# Altium project 243-TGE-Template.PrjPcb
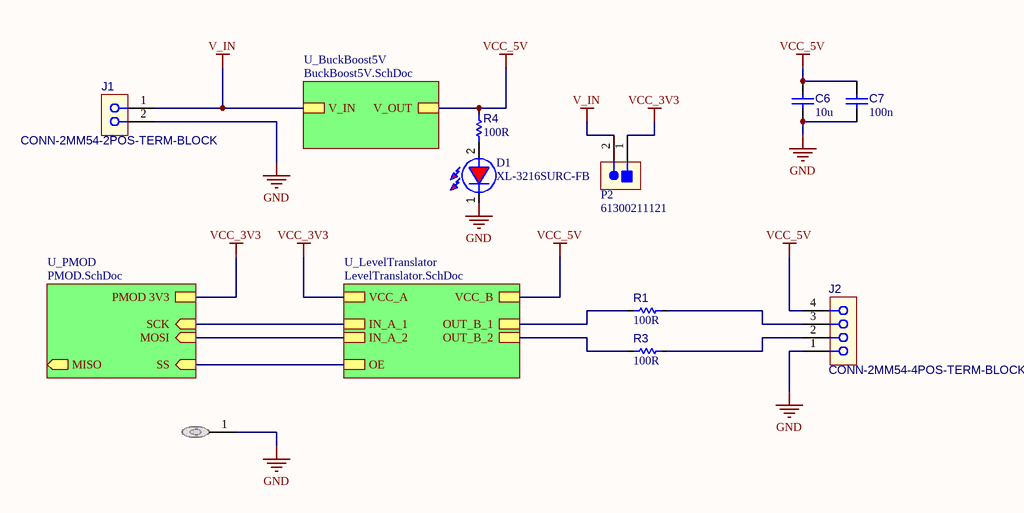
[diagram p0: HeadSheet.SchDoc]
NomDeLetudiant: Le nom de l'étudiant; NomDeProjet: Le nom de mon Projet; Revision: La Revision
4 sheets, 22 parts. Net scope: hierarchical (ports join the sheet entries above them; power ports are global).
Board file: Pcb1.PcbDoc
Sheets:
  HeadSheet.SchDoc
    U_BuckBoost5V = BuckBoost5V.SchDoc
    U_LevelTranslator = LevelTranslator.SchDoc
    U_PMOD = PMOD.SchDoc

## Sheet HeadSheet.SchDoc: Headsheet
size Letter; ApprovedBy: Kevin; Author: Jessica; Organization: Cegep Limoilou; Address1: 1300, 8e Avenue; Address2: Québec, QC; Address3: Canada; Address4: G1J 5L5; Revision: A; SheetNumber: 1; SheetTotal: 4

### Parts
C6  value 10u  [C_2012[0805]]  (hidden comment: CAP CER 10uF 10V X7R 0805)
C7  value 100n  [C_1608[0603]]  (hidden comment: CAP CER 100nF 50V 0603)
D1  XL-3216SURC-FB  [LED 1206]
J1  CONN-2MM54-2POS-TERM-BLOCK  [CONN_TERM_BLOCK_2POS_100MIL]
J2  CONN-2MM54-4POS-TERM-BLOCK  [CONN_TERM_BLOCK_4POS_100MIL]
MH1  DNP  [MP_M-Hole_#4-40_LOOSE-FIT]  (value not drawn)  (no BOM)
P2  61300211121  [CONN_HDR_2POS_100MILS_TH]
R1  value 100R  [R_1608[0603]]  (hidden comment: Res 100R 1% 0603)
R3  value 100R  [R_1608[0603]]  (hidden comment: Res 100R 1% 0603)
R4  value 100R  [R_1608[0603]]  (hidden comment: Res 100R 1% 0603)

### Sub-sheets
U_BuckBoost5V = BuckBoost5V.SchDoc: V_IN, V_OUT
U_LevelTranslator = LevelTranslator.SchDoc: VCC_A, VCC_B, OUT_B_1, OUT_B_2, IN_A_1, IN_A_2, OE
U_PMOD = PMOD.SchDoc: PMOD 3V3, SCK (in), MOSI (in), SS (in), MISO (out)

### Nets
GND: C6.1 C7.1 D1.1(K) J1.2 J2.1 MH1.1
V_IN: J1.1 P2.2 ; sheet U_BuckBoost5V/V_IN
VCC_3V3: P2.1 ; sheet U_LevelTranslator/VCC_A, sheet U_PMOD/PMOD 3V3
VCC_5V: C6.2 C7.2 J2.4 R4.2 ; sheet U_BuckBoost5V/V_OUT, sheet U_LevelTranslator/VCC_B
IN_A_1: sheet U_LevelTranslator/IN_A_1, sheet U_PMOD/SCK
IN_A_2: sheet U_LevelTranslator/IN_A_2, sheet U_PMOD/MOSI
OE: sheet U_LevelTranslator/OE, sheet U_PMOD/SS
OUT_B_1: R1.1 ; sheet U_LevelTranslator/OUT_B_1
OUT_B_2: R3.1 ; sheet U_LevelTranslator/OUT_B_2
NetD1_2: D1.2(A) R4.1
NetJ2_2: J2.2 R3.2
NetJ2_3: J2.3 R1.2

### Notes on the sheet
- Titre :
- Conception :
- Date :
- Approbation :
- Heure :
- Révision :
- Feuille
- de
- Fichier :

### Library data of the parts
C6 = CAP004: Capacitor type 1; Manufacturer 1: muRata; Manufacturer Part Number 1: GRM21BR71A106KE51L; LibRef: CAP004; Code CEGEP: KCOND03SM; Tolerance: 10%; Rated Voltage: 10V; Dielectric: X7R; Mounting Technology: SMT; Supplier 1: LCSC; Supplier Part Number 1: C86038
C7 = CAP002: Capacitor type 1; Manufacturer 1: Yageo; Manufacturer Part Number 1: CC0603KRX7R9BB104; LibRef: CAP002; Code CEGEP: COND0143SM; Tolerance: 10%; Dielectric: X7R; Rated Voltage: 50V; Mounting Technology: SMT; Supplier 1: LCSC; Supplier Part Number 1: C14663
D1 = D_LED_RED_1206: DEL Rouge 1206; Manufacturer 1: XINGLIGHT; Code CEGEP: LEDROUGECLAIR; Localisation: AVP-14; Manufacturer Part Number 1: XL-3216SURC-FB; Supplier 1: LCSC; Supplier Part Number 1: C3646938; Manufacturer 2: Würth Elektronik; Manufacturer Part Number 2: 150120RS75000; Supplier 2: Digikey; Supplier Part Number 2: 732-4991-1-ND; Mounting Technology: SMT
J1 = CONN-2MM54-2POS-TERM-BLOCK: CONN TERM BLOCK 2POS 100mil pitch; Manufacturer 1: Dorabo; Manufacturer Part Number 1: DB125-2.54-2P-GN-S; Supplier 1: LCSC; Supplier Part Number 1: C918120; Mounting Technology: TH; Manufacturer 2: Amphenol; Manufacturer Part Number 2: VN02A1500000G; Supplier 2: Digikey; Supplier Part Number 2: VN02A1500000G-ND
J2 = CONN-2MM54-4POS-TERM-BLOCK: CONN TERM BLOCK 4POS 100mil pitch; Manufacturer 1: Dorabo; Manufacturer Part Number 1: DB125-2.54-4P-GN-S; Supplier 1: LCSC; Supplier Part Number 1: C918122; Mounting Technology: TH; Manufacturer 2: Amphenol; Manufacturer Part Number 2: VN04A1500000G; Supplier 2: Digikey; Supplier Part Number 2: VN04A1500000G-ND
MH1 = MH-4-40: Mounting Hole #4-40 w/ Flat Washer; Manufacturer Part Number 1: DNP; Mounting Technology: N/A; Value: Mounting Hole #4-40 w/ Flat Washer; Supplier Part Number 1: N/A
P2 = CONN-100MIL-HDR-01X02: CONN HEADER 2POS 100MIL; Manufacturer 1: Megastar; Manufacturer Part Number 1: ZX-PZ2.54-1-2PZZ; Mounting Technology: TH; Supplier 1: LCSC; Supplier Part Number 1: C7501260; Manufacturer 2: Würth Elektronik; Manufacturer Part Number 2: 61300211121
R1 R3 R4 = RES029: Resistor type 1; Manufacturer 1: Yageo; Manufacturer Part Number 1: RC0603FR-07100RL; LibRef: RES029; Puissance: 1/10W; Max Working Voltage: 75V; Tolerance: 1%; Mounting Technology: SMT; Supplier 1: LCSC; Supplier Part Number 1: C105588

## Sheet BuckBoost5V.SchDoc: BuckBoost
size Letter; ApprovedBy: Kevin; Author: Jessica; Organization: Cegep Limoilou; Address1: 1300, 8e Avenue; Address2: Québec, QC; Address3: Canada; Address4: G1J 5L5; Revision: A; SheetNumber: 2; SheetTotal: 4
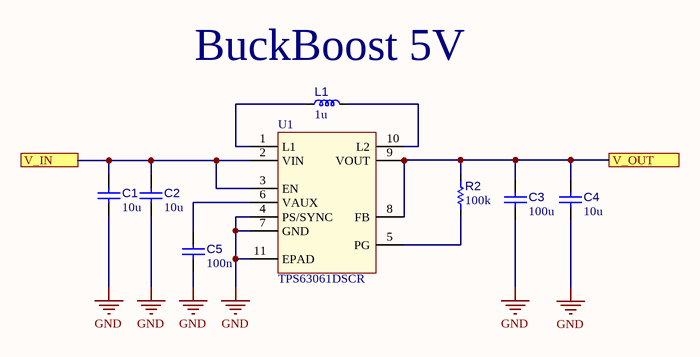
[diagram p1: BuckBoost5V.SchDoc]

### Parts
C1  value 10u  [C_2012[0805]]  (hidden comment: CAP CER 10uF 10V X7R 0805)
C2  value 10u  [C_2012[0805]]  (hidden comment: CAP CER 10uF 10V X7R 0805)
C3  value 100u  [C_3216[1206]]  (hidden comment: CAP CER 100uF 10V 1206)
C4  value 10u  [C_2012[0805]]  (hidden comment: CAP CER 10uF 10V X7R 0805)
C5  value 100n  [C_1005[0402]]  (hidden comment: CAP CER 100nF 50V 0402)
L1  value 1u  [L_4040[1515]]  (hidden comment: Inductor 1UH 3.2A 32mΩ SMD)
R2  value 100k  [R_1608[0603]]  (hidden comment: Res 100k 1% 0603)
U1  TPS63061DSCR  [U_WSON50P300X300X80-10N]

### Ports
V_IN, V_OUT

### Nets
GND: C1.1 C2.1 C3.1 C4.1 C5.1 U1.4(PS/SYNC) U1.7(GND) U1.11(EPAD)
V_IN: C1.2 C2.2 U1.2(VIN) U1.3(EN) ; port V_IN
VCC_5V: C3.2 C4.2 R2.2 U1.8(FB) U1.9(VOUT) ; port V_OUT
NetC5_2: C5.2 U1.6(VAUX)
NetL1_1: L1.1 U1.1(L1)
NetL1_2: L1.2 U1.10(L2)
NetR2_1: R2.1 U1.5(PG)

### Notes on the sheet
- (near L1) BuckBoost 5V
- Titre :
- Conception :
- Date :
- Approbation :
- Heure :
- Révision :
- Feuille
- de
- Fichier :

### Library data of the parts
C1 C2 C4 = CAP004: as C6 on sheet HeadSheet; Rated Voltage: 10V; Dielectric: X7R; Mounting Technology: SMT; Supplier 1: LCSC; Supplier Part Number 1: C86038
C3 = CAP005: Capacitor type 1; Manufacturer 1: Murata; Manufacturer Part Number 1: GRM31CR61A107MEA8L; LibRef: CAP005; Code CEGEP: KCOND04SM; Tolerance: 20%; Dielectric: X5R; Rated Voltage: 10V; Mounting Technology: SMT; Supplier 1: LCSC; Supplier Part Number 1: C883598
C5 = CAP001: Capacitor type 1; Manufacturer 1: Yageo; Manufacturer Part Number 1: CC0402KRX7R9BB104; LibRef: CAP001; Code CEGEP: KCOND01SM; Tolerance: 10%; Dielectric: X7R; Rated Voltage: 50V; Mounting Technology: SMT; Supplier 1: LCSC; Supplier Part Number 1: C131394
L1 = IND006: Inductor type 1; Manufacturer 1: Taiyo Yuden; Manufacturer Part Number 1: LSXND4040TKL1R0NDG; LibRef: IND006; Tolerance: 30%; Saturation Current: 4A; DCR: 0R032; Mounting Technology: SMT; Supplier 1: LCSC; Supplier Part Number 1: C6891223
R2 = RES002: Resistor type 1; Manufacturer 1: Yageo; Manufacturer Part Number 1: RC0603FR-07100KL; LibRef: RES002; Puissance: 1/10W; Max Working Voltage: 75V; Tolerance: 1%; Mounting Technology: SMT; Supplier 1: LCSC; Supplier Part Number 1: C14675
U1 = U_TPS63061DSC: IC REG BUCK BOOST 5V 2A 10WSON; Manufacturer 1: TI; Manufacturer Part Number 1: TPS63061DSCR; Mounting Technology: SMT; Supplier 1: LCSC; Supplier 2: Digikey; Supplier Part Number 1: C2876326; Supplier Part Number 2: 296-30205-1-ND

## Sheet LevelTranslator.SchDoc: LevelTranslator
size Letter; ApprovedBy: Kevin; Author: Jessica; Organization: Cegep Limoilou; Address1: 1300, 8e Avenue; Address2: Québec, QC; Address3: Canada; Address4: G1J 5L5; Revision: A; SheetNumber: 4; SheetTotal: 4
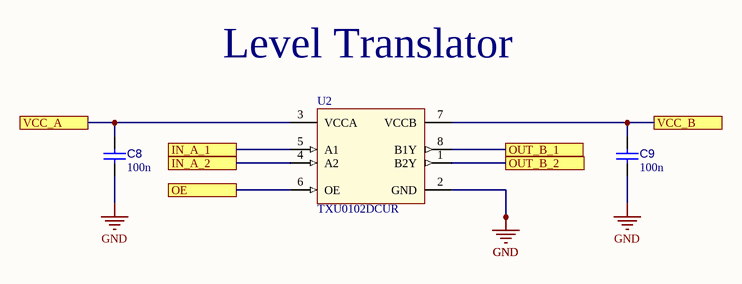
[diagram p2: LevelTranslator.SchDoc]

### Parts
C8  value 100n  [C_1608[0603]]  (hidden comment: CAP CER 100nF 50V 0603)
C9  value 100n  [C_1608[0603]]  (hidden comment: CAP CER 100nF 50V 0603)
U2  TXU0102DCUR  [U_VSSOP50P310X200X90-8N]

### Ports
IN_A_1, IN_A_2, OE, OUT_B_1, OUT_B_2, VCC_A, VCC_B

### Nets
GND: C8.1 C9.1 U2.2(GND)
VCC_3V3: C8.2 U2.3(VCCA) ; port VCC_A
VCC_5V: C9.2 U2.7(VCCB) ; port VCC_B
IN_A_1: U2.5(A1) ; port IN_A_1
IN_A_2: U2.4(A2) ; port IN_A_2
OE: U2.6(OE) ; port OE
OUT_B_1: U2.8(B1Y) ; port OUT_B_1
OUT_B_2: U2.1(B2Y) ; port OUT_B_2

### Notes on the sheet
- Level Translator
- Titre :
- Conception :
- Date :
- Approbation :
- Heure :
- Révision :
- Feuille
- de
- Fichier :

### Library data of the parts
C8 C9 = CAP002: as C7 on sheet HeadSheet; Rated Voltage: 50V; Mounting Technology: SMT; Supplier 1: LCSC; Supplier Part Number 1: C14663
U2 = U_TXU0102DCU: Two channel fixed-direction level shifter 8-VSSOP; Manufacturer 1: TI; Manufacturer Part Number 1: TXU0102DCUR; Mounting Technology: SMT; Supplier 1: LCSC; Supplier 2: Digikey; Supplier Part Number 1: C5217871; Supplier Part Number 2: 296-TXU0102DCURCT-ND

## Sheet PMOD.SchDoc: PMOD
size Letter; ApprovedBy: Kevin; Author: Jessica; Organization: Cegep Limoilou; Address1: 1300, 8e Avenue; Address2: Québec, QC; Address3: Canada; Address4: G1J 5L5; Revision: A; SheetNumber: 3; SheetTotal: 4
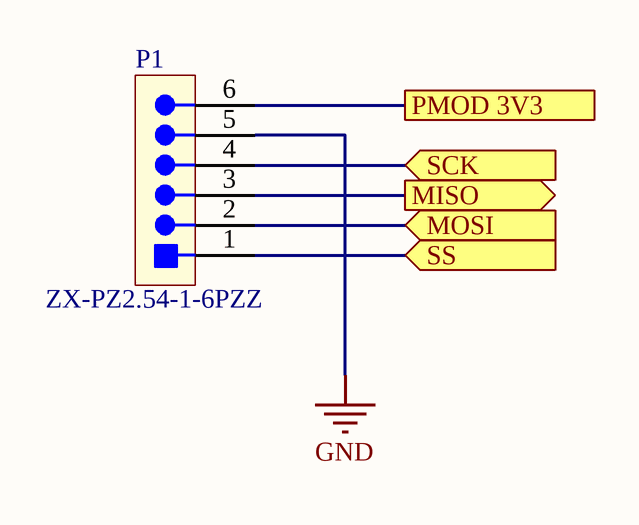
[diagram p3: PMOD.SchDoc]

### Parts
P1  ZX-PZ2.54-1-6PZZ  [CONN_HDR_01X06_100MIL]  (no BOM)

### Ports
MISO (out), MOSI (in), PMOD 3V3, SCK (in), SS (in)

### Nets
GND: P1.5
VCC_3V3: P1.6 ; port PMOD 3V3
IN_A_1: P1.4 ; port SCK
IN_A_2: P1.2 ; port MOSI
MISO: P1.3 ; port MISO
OE: P1.1 ; port SS

### Notes on the sheet
- Titre :
- Conception :
- Date :
- Approbation :
- Heure :
- Révision :
- Feuille
- de
- Fichier :

### Library data of the parts
P1 = CONN-100MIL-HDR-01X06: Conn. Header 6pos 100mils; Manufacturer 1: Megastar; Mounting Technology: TH; Manufacturer Part Number 1: ZX-PZ2.54-1-6PZZ; Manufacturer 2: Würth Elektronik; Manufacturer Part Number 2: 61300611121; Supplier 1: LCSC; Supplier 2: Digikey; Supplier Part Number 2: 732-5319-ND; Supplier Part Number 1: C7501264

## Nets that join several sheets
GND: HeadSheet (6 pins), BuckBoost5V (8 pins), LevelTranslator (C8.1 C9.1 U2.2), PMOD (P1.5)
V_IN: HeadSheet (J1.1 P2.2), BuckBoost5V (C1.2 C2.2 U1.2 U1.3)
VCC_3V3: HeadSheet (P2.1), LevelTranslator (C8.2 U2.3), PMOD (P1.6)
VCC_5V: HeadSheet (C6.2 C7.2 J2.4 R4.2), BuckBoost5V (5 pins), LevelTranslator (C9.2 U2.7)
IN_A_1: LevelTranslator (U2.5), PMOD (P1.4)
IN_A_2: LevelTranslator (U2.4), PMOD (P1.2)
OE: LevelTranslator (U2.6), PMOD (P1.1)
OUT_B_1: HeadSheet (R1.1), LevelTranslator (U2.8)
OUT_B_2: HeadSheet (R3.1), LevelTranslator (U2.1)